# EasyEDA schematic SCH_LineFollower_2022-10-18.json
TITLE: Elektrisch schema line follower; REV: 1.0; Date: 2022-10-11; Sheet: 1/1; Company: Arno, Jelle, Ruben
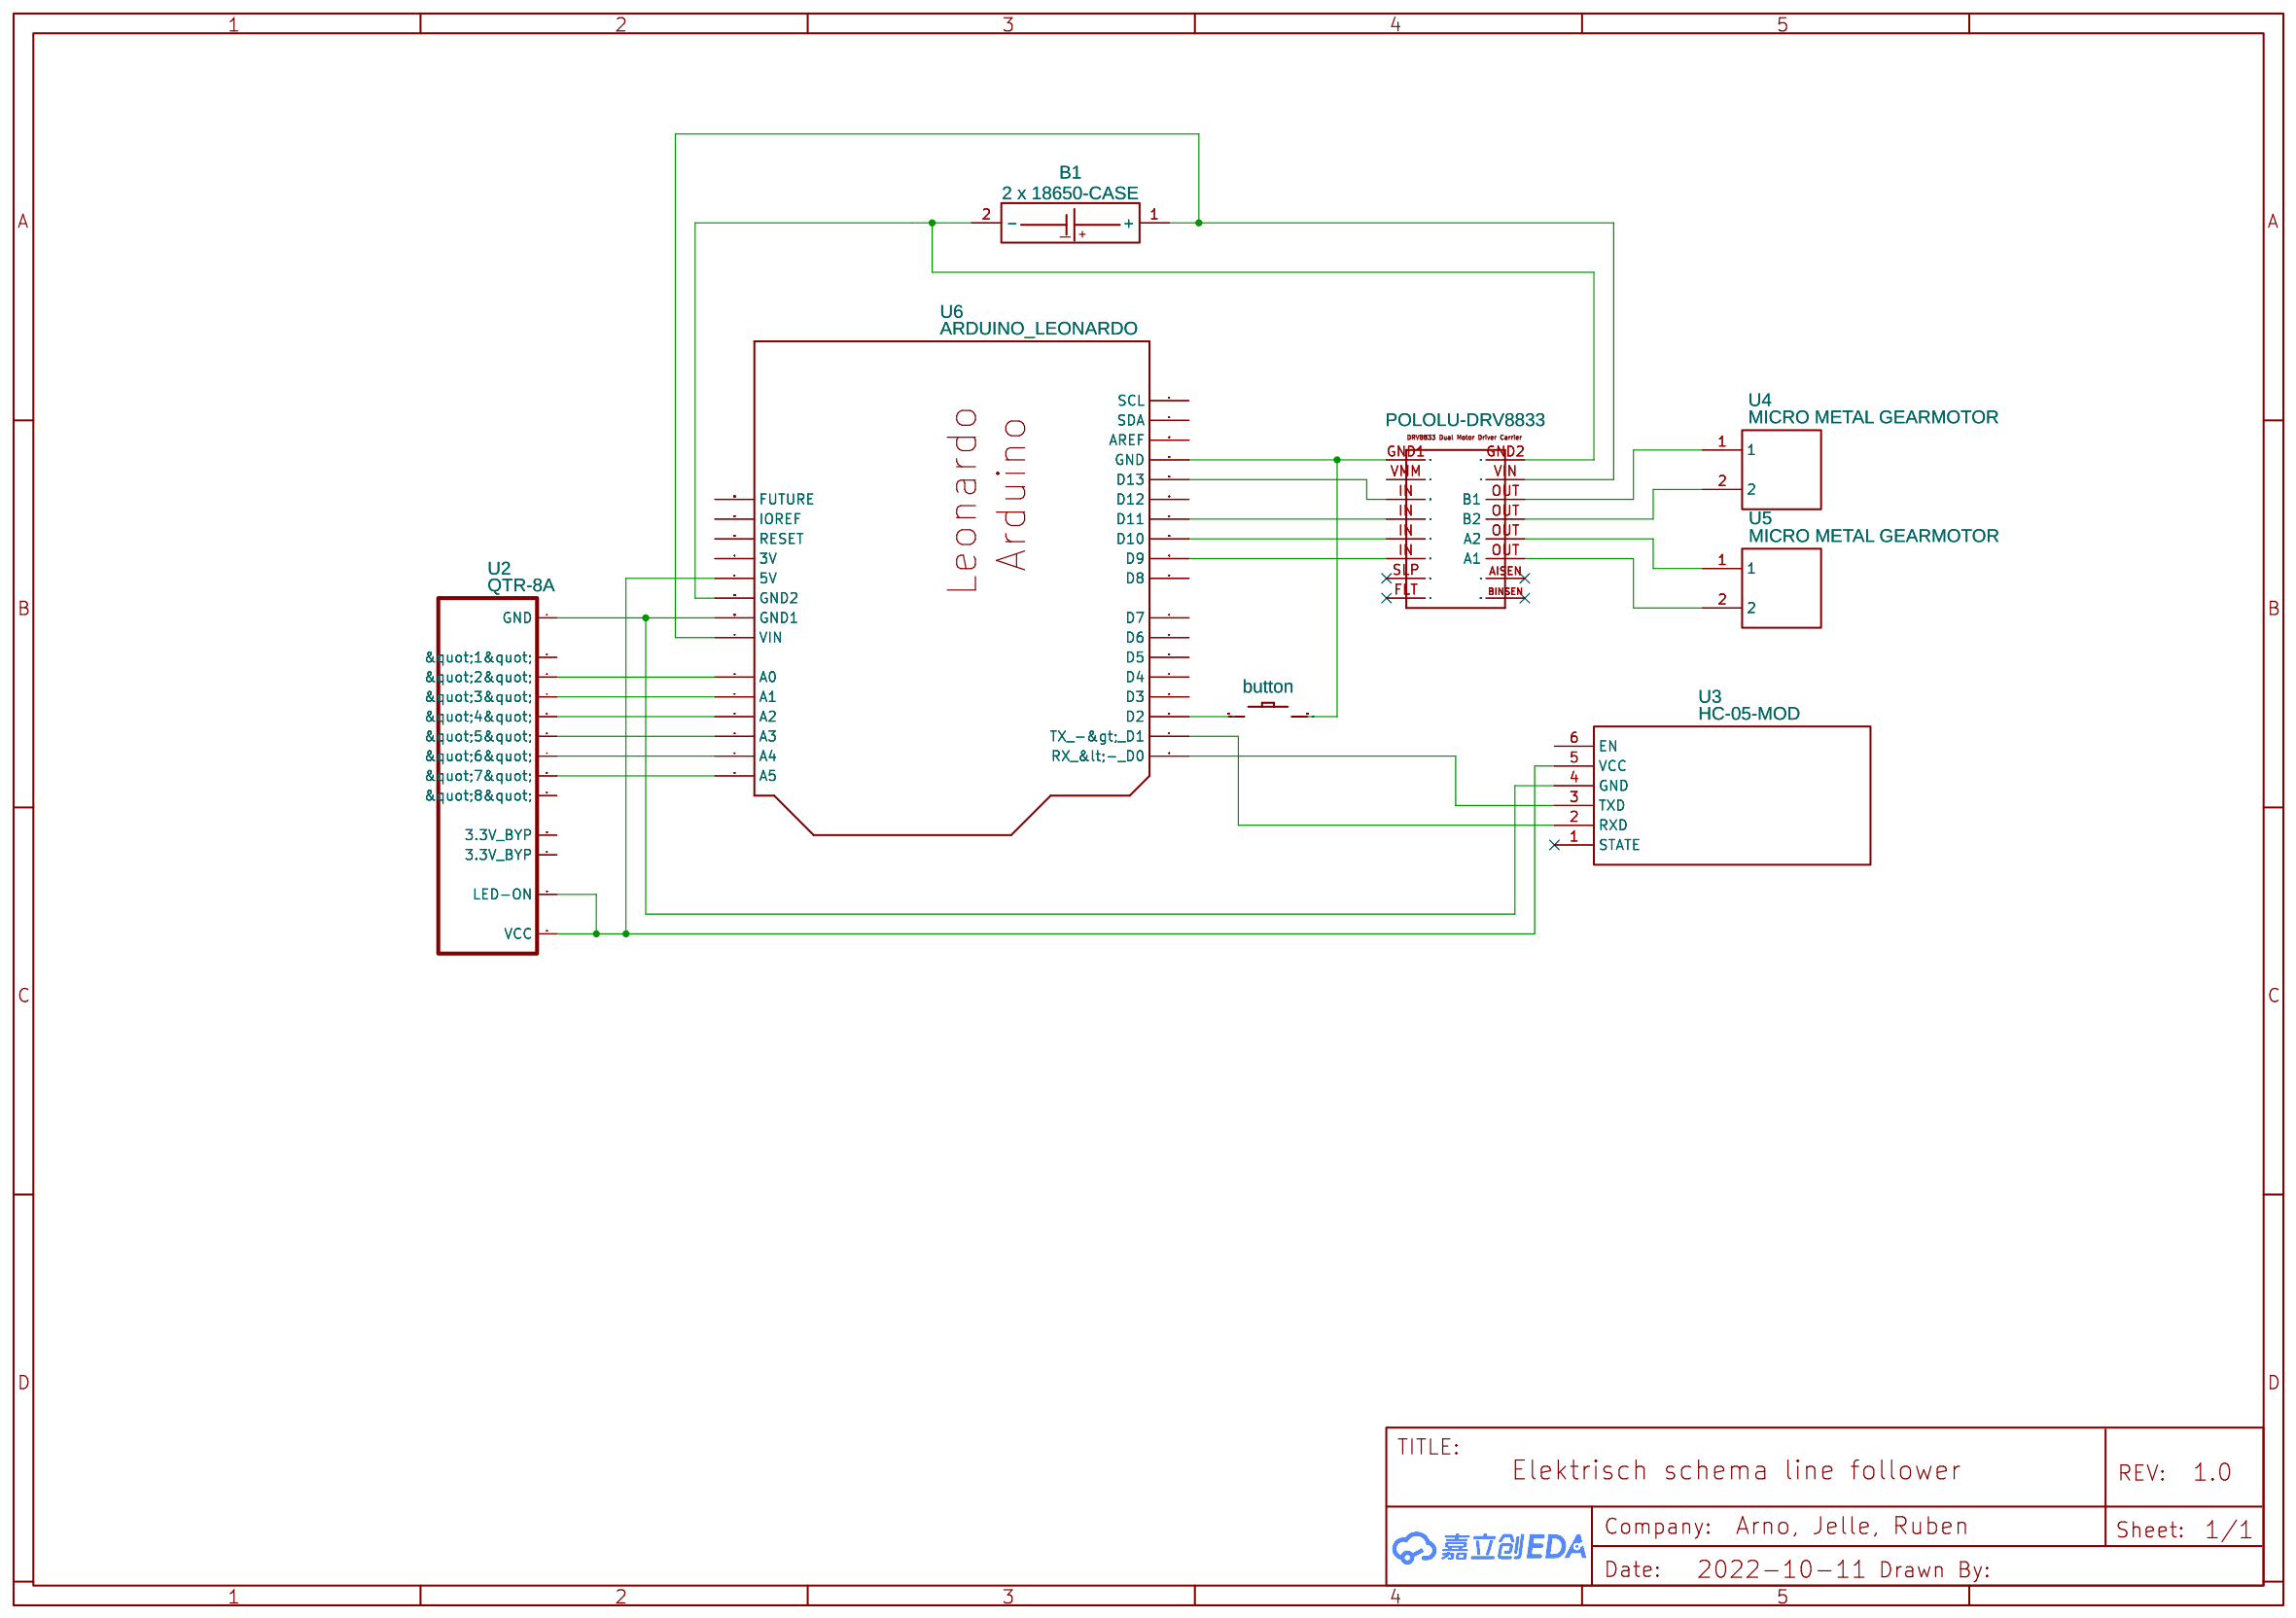
[diagram p0: schematic sheet]

## Parts
1  POLOLU-DRV8833  [POLOLU-DRV8833]
2  button  [32TEETH---CONDUCTIVE-BUTTONS_CONDUCTIVE_BUTTON_DIRECTIONAL_THICK]
B1  2 x 18650-CASE  [18650-X1-SMT-CASE]
U2  QTR-8A  [QTR-8A/8RC]
U3  HC-05-MOD  [HC-05-MOD]
U4  MICRO METAL GEARMOTOR  [POLOLU MICRO METAL GEARMOTOR, SINGLE SHAFT]
U5  MICRO METAL GEARMOTOR  [POLOLU MICRO METAL GEARMOTOR, SINGLE SHAFT]
U6  ARDUINO_LEONARDO  [ARDUINO_LEONARDO]

## Library data of the parts
1 = POLOLU-DRV8833: Contributor: cherry printact; Package Display: No
2 = button: Contributor: LorenzoVonMatterhorn
B1 = 18650-X1-SMT-CASE: Manufacturer Part: 18650-X1-SMT; Contributor: Александр Концевой
U2 = QTR-8A: Manufacturer: Pololu; Supplier: Pololu; Supplier Part: 960; link: https://www.pololu.com/docs/pdf/0J12/QTR-8x.pdf; Contributor: Junikos
U3 = HC-05-MOD: Contributor: Firdavs
U4 U5 = POLOLU MICRO METAL GEARMOTOR, FOR PRE-USED MOTORS: Manufacturer: Pololu; Supplier: Pololu; link: https://www.pololu.com/category/60/micro-metal-gearmotors; Contributor: kyodainoito
U6 = ARDUINO_LEONARDO: Contributor: longer8890

## Nets
Net-(1-GND1): 1.GND1 2.P$ACTIVE U6.GND
Net-(1-GND2): 1.GND2 B1.2(-) U6.GND$2(GND2)
Net-(1-IN): 1.IN(INB1) U6.D9 U6.D10 U6.D11 U6.D13
Net-(1-OUT): 1.OUT(B1) U4.1 U4.2 U5.1 U5.2
Net-(1-VIN): 1.VIN B1.1(+) U6.VIN
Net-(2-P$GND): 2.P$GND U6.D2
Net-(U2-1): U2.1(GND) U3.4(GND) U6.GND$3(GND1)
Net-(U2-3): U2.3("2") U6.A0
Net-(U2-4): U2.4("3") U6.A1
Net-(U2-5): U2.5("4") U6.A2
Net-(U2-6): U2.6("5") U6.A3
Net-(U2-7): U2.7("6") U6.A4
Net-(U2-8): U2.8("7") U6.A5
Net-(U2-12): U2.12(LED-ON) U3.5(VCC) U6.5V
Net-(U3-2): U3.2(RXD) U6.D1(TX -> D1)
Net-(U3-3): U3.3(TXD) U6.D0(RX <- D0)

Not connected (* = marked no-connect by the designer): 1 AISEN* BINSEN(BISEN)* FLT* SLP* VMM; U2 2("1") 9("8") 10(3.3V BYP) 11(3.3V BYP); U3 1(STATE)* 6(EN); U6 3V AREF D3 D4 D5 D6 D7 D8 D12 IOREF RESERVED(FUTURE) RESET SCL SDA
